# Altium schematic sheet Sitara_DDR.SchDoc
size A3; SheetNumber: 6; SheetTotal: 10
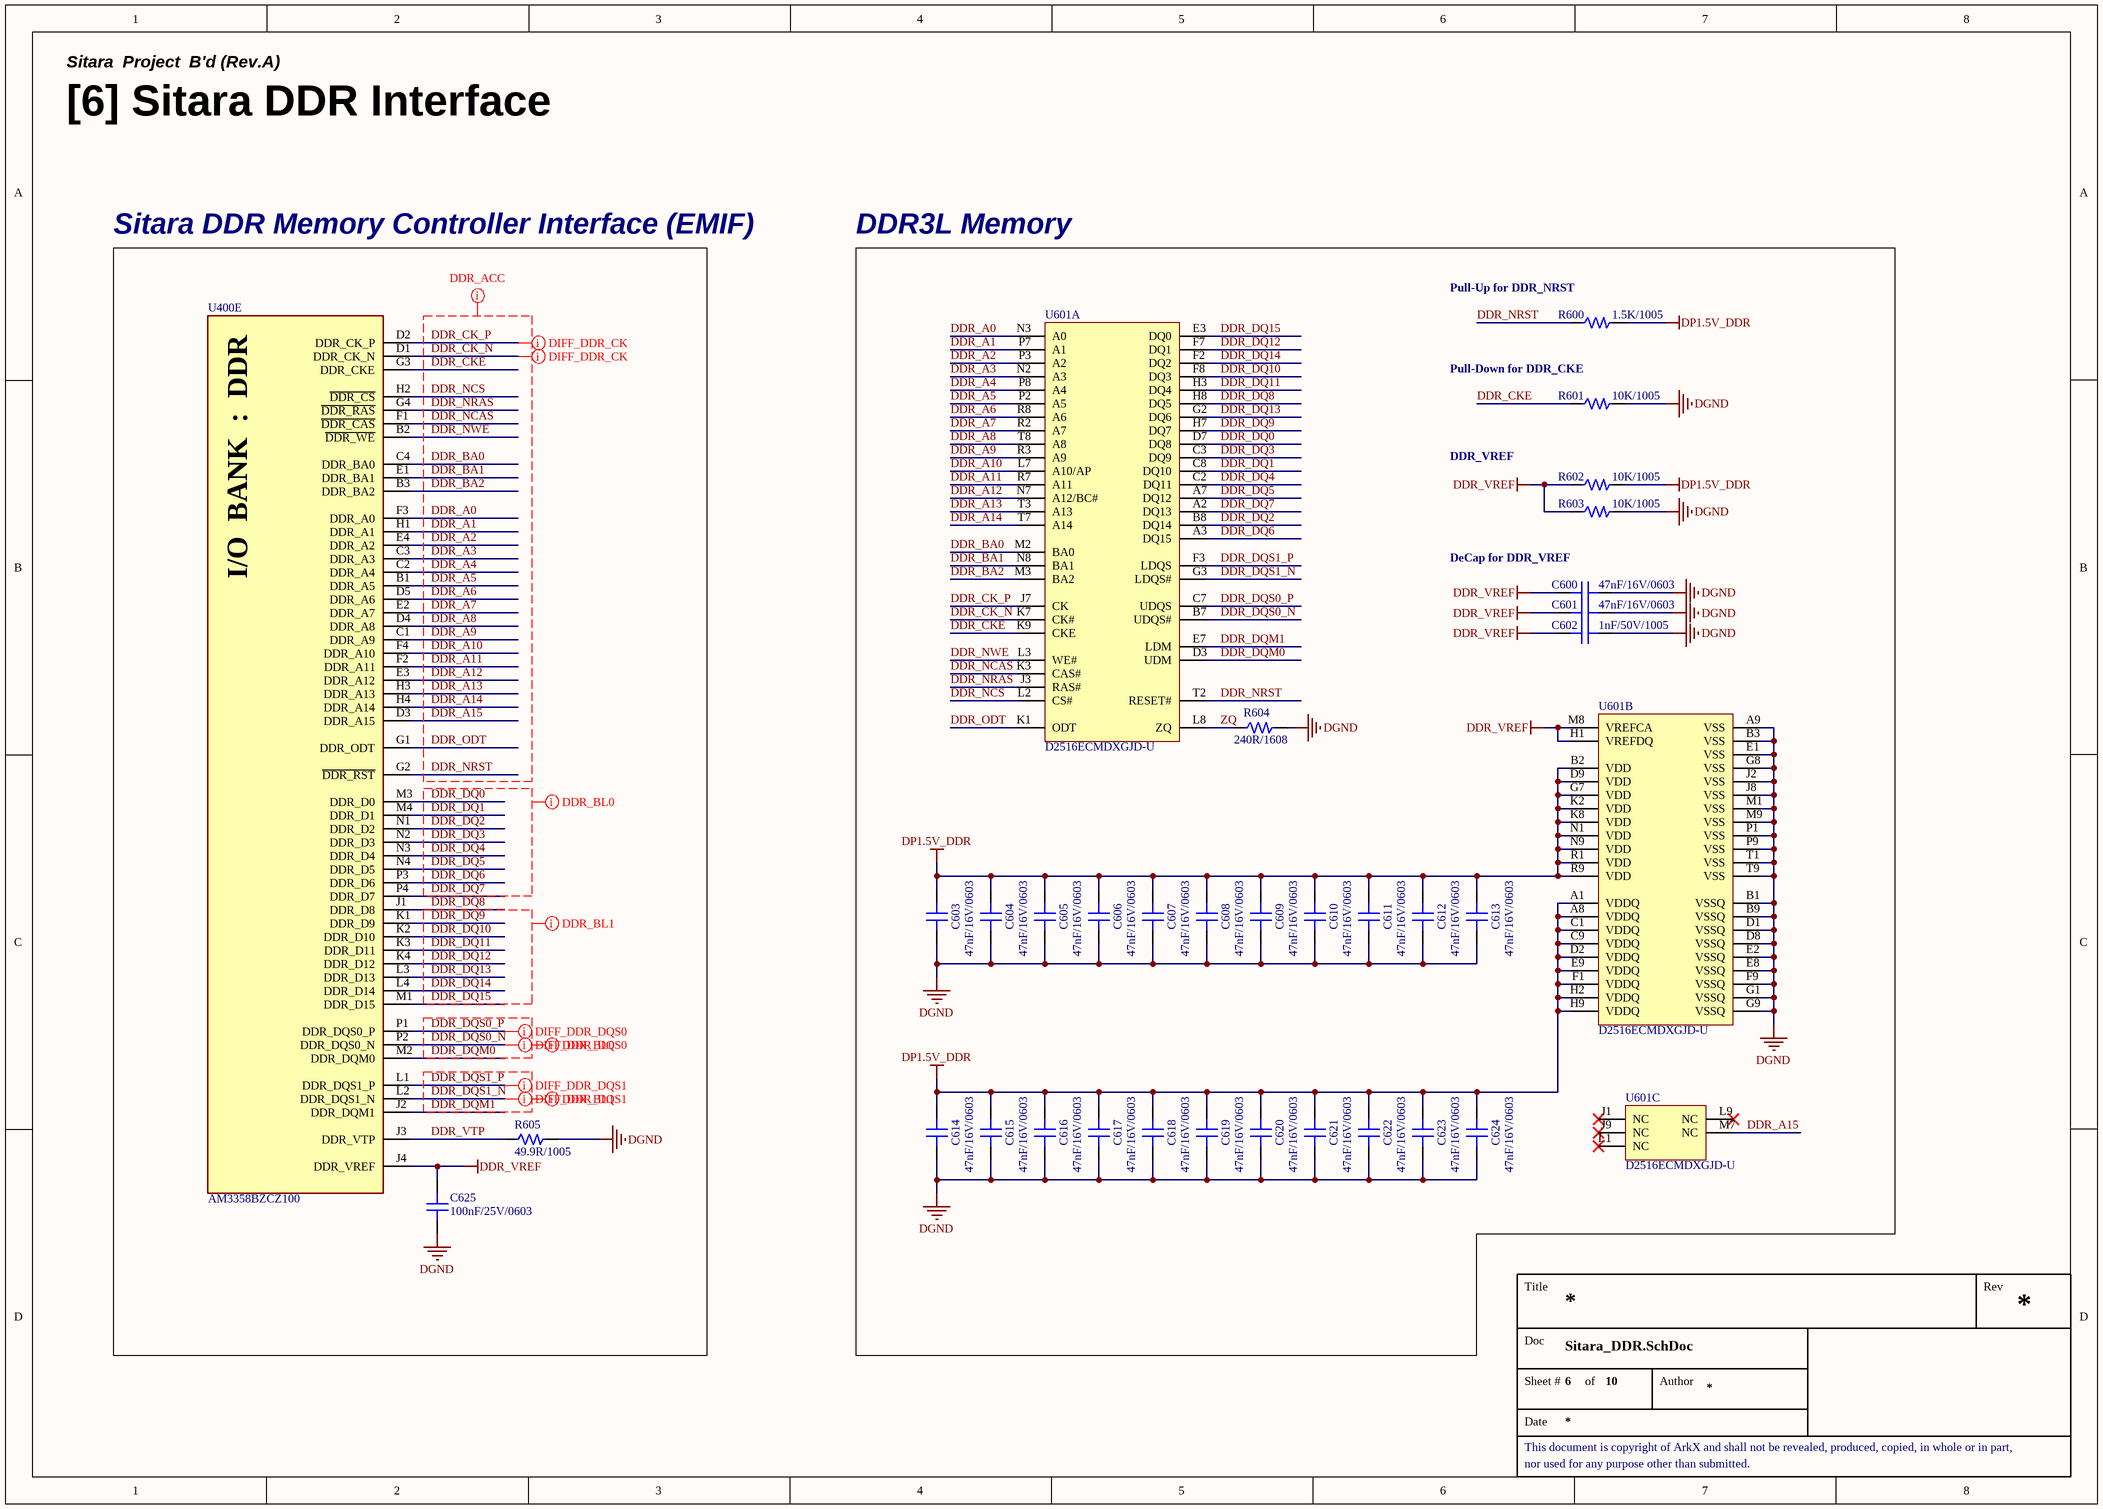
[diagram p0: Sitara_DDR.SchDoc]

## Parts
C600  47nF/16V/0603  [CAP 0603 (0201_INCH)]
C601  47nF/16V/0603  [CAP 0603 (0201_INCH)]
C602  1nF/50V/1005  [CAP 1005 (0402_INCH)]
C603  47nF/16V/0603  [CAP 0603 (0201_INCH)]
C604  47nF/16V/0603  [CAP 0603 (0201_INCH)]
C605  47nF/16V/0603  [CAP 0603 (0201_INCH)]
C606  47nF/16V/0603  [CAP 0603 (0201_INCH)]
C607  47nF/16V/0603  [CAP 0603 (0201_INCH)]
C608  47nF/16V/0603  [CAP 0603 (0201_INCH)]
C609  47nF/16V/0603  [CAP 0603 (0201_INCH)]
C610  47nF/16V/0603  [CAP 0603 (0201_INCH)]
C611  47nF/16V/0603  [CAP 0603 (0201_INCH)]
C612  47nF/16V/0603  [CAP 0603 (0201_INCH)]
C613  47nF/16V/0603  [CAP 0603 (0201_INCH)]
C614  47nF/16V/0603  [CAP 0603 (0201_INCH)]
C615  47nF/16V/0603  [CAP 0603 (0201_INCH)]
C616  47nF/16V/0603  [CAP 0603 (0201_INCH)]
C617  47nF/16V/0603  [CAP 0603 (0201_INCH)]
C618  47nF/16V/0603  [CAP 0603 (0201_INCH)]
C619  47nF/16V/0603  [CAP 0603 (0201_INCH)]
C620  47nF/16V/0603  [CAP 0603 (0201_INCH)]
C621  47nF/16V/0603  [CAP 0603 (0201_INCH)]
C622  47nF/16V/0603  [CAP 0603 (0201_INCH)]
C623  47nF/16V/0603  [CAP 0603 (0201_INCH)]
C624  47nF/16V/0603  [CAP 0603 (0201_INCH)]
C625  100nF/25V/0603  [CAP 0603 (0201_INCH)]
R600  1.5K/1005  [RES 1005 (0402_inch)]
R601  10K/1005  [RES 1005 (0402_inch)]
R602  10K/1005  [RES 1005 (0402_inch)]
R603  10K/1005  [RES 1005 (0402_inch)]
R604  240R/1608  [RES 1608 (0603_inch)]
R605  49.9R/1005  [RES 1005 (0402_inch)]
U400  AM3358BZCZ100  [IC_SOC_AM3358BZCZ100]  (part E of 8)
U601  D2516ECMDXGJD-U  [IC_MEM_DDR3L_MT41K256M16TW-107 IT:P]  (parts A,B,C of 3)

## Blocks framed on the sheet
Sitara DDR Memory Controller Interface (EMIF): C625 R605 U400
DDR3L Memory: C600-C624 R600-R604 U601

## Nets
DDR_VREF: C600.1 C601.1 C602.1 C625.2 R602.1 R603.1 U400.J4(DDR_VREF) U601.H1(VREFDQ) U601.M8(VREFCA)
DGND: C600.2 C601.2 C602.2 C603.1 C604.1 C605.1 C606.1 C607.1 C608.1 C609.1 C610.1 C611.1 C612.1 C613.1 C614.1 C615.1 C616.1 C617.1 C618.1 C619.1 C620.1 C621.1 C622.1 C623.1 C624.1 C625.1 R601.2 R603.2 R604.2 R605.2 U601.A9(VSS) U601.B1(VSSQ) U601.B3(VSS) U601.B9(VSSQ) U601.D1(VSSQ) U601.D8(VSSQ) U601.E1(VSS) U601.E2(VSSQ) U601.E8(VSSQ) U601.F9(VSSQ) U601.G1(VSSQ) U601.G8(VSS) U601.G9(VSSQ) U601.J2(VSS) U601.J8(VSS) U601.M1(VSS) U601.M9(VSS) U601.P1(VSS) U601.P9(VSS) U601.T1(VSS) U601.T9(VSS)
DP1.5V_DDR: C603.2 C604.2 C605.2 C606.2 C607.2 C608.2 C609.2 C610.2 C611.2 C612.2 C613.2 C614.2 C615.2 C616.2 C617.2 C618.2 C619.2 C620.2 C621.2 C622.2 C623.2 C624.2 R600.2 R602.2 U601.A1(VDDQ) U601.A8(VDDQ) U601.B2(VDD) U601.C1(VDDQ) U601.C9(VDDQ) U601.D2(VDDQ) U601.D9(VDD) U601.E9(VDDQ) U601.F1(VDDQ) U601.G7(VDD) U601.H2(VDDQ) U601.H9(VDDQ) U601.K2(VDD) U601.K8(VDD) U601.N1(VDD) U601.N9(VDD) U601.R1(VDD) U601.R9(VDD)
DDR_A0: U400.F3(DDR_A0) U601.N3(A0)
DDR_A1: U400.H1(DDR_A1) U601.P7(A1)
DDR_A2: U400.E4(DDR_A2) U601.P3(A2)
DDR_A3: U400.C3(DDR_A3) U601.N2(A3)
DDR_A4: U400.C2(DDR_A4) U601.P8(A4)
DDR_A5: U400.B1(DDR_A5) U601.P2(A5)
DDR_A6: U400.D5(DDR_A6) U601.R8(A6)
DDR_A7: U400.E2(DDR_A7) U601.R2(A7)
DDR_A8: U400.D4(DDR_A8) U601.T8(A8)
DDR_A9: U400.C1(DDR_A9) U601.R3(A9)
DDR_A10: U400.F4(DDR_A10) U601.L7(A10/AP)
DDR_A11: U400.F2(DDR_A11) U601.R7(A11)
DDR_A12: U400.E3(DDR_A12) U601.N7(A12/BC#)
DDR_A13: U400.H3(DDR_A13) U601.T3(A13)
DDR_A14: U400.H4(DDR_A14) U601.T7(A14)
DDR_A15: U400.D3(DDR_A15) U601.M7(NC)
DDR_BA0: U400.C4(DDR_BA0) U601.M2(BA0)
DDR_BA1: U400.E1(DDR_BA1) U601.N8(BA1)
DDR_BA2: U400.B3(DDR_BA2) U601.M3(BA2)
DDR_CK_N: U400.D1(DDR_CK_N) U601.K7(CK#)
DDR_CK_P: U400.D2(DDR_CK_P) U601.J7(CK)
DDR_CKE: R601.1 U400.G3(DDR_CKE) U601.K9(CKE)
DDR_DQ0: U400.M3(DDR_D0) U601.D7(DQ8)
DDR_DQ1: U400.M4(DDR_D1) U601.C8(DQ10)
DDR_DQ2: U400.N1(DDR_D2) U601.B8(DQ14)
DDR_DQ3: U400.N2(DDR_D3) U601.C3(DQ9)
DDR_DQ4: U400.N3(DDR_D4) U601.C2(DQ11)
DDR_DQ5: U400.N4(DDR_D5) U601.A7(DQ12)
DDR_DQ6: U400.P3(DDR_D6) U601.A3(DQ15)
DDR_DQ7: U400.P4(DDR_D7) U601.A2(DQ13)
DDR_DQ8: U400.J1(DDR_D8) U601.H8(DQ5)
DDR_DQ9: U400.K1(DDR_D9) U601.H7(DQ7)
DDR_DQ10: U400.K2(DDR_D10) U601.F8(DQ3)
DDR_DQ11: U400.K3(DDR_D11) U601.H3(DQ4)
DDR_DQ12: U400.K4(DDR_D12) U601.F7(DQ1)
DDR_DQ13: U400.L3(DDR_D13) U601.G2(DQ6)
DDR_DQ14: U400.L4(DDR_D14) U601.F2(DQ2)
DDR_DQ15: U400.M1(DDR_D15) U601.E3(DQ0)
DDR_DQM0: U400.M2(DDR_DQM0) U601.D3(UDM)
DDR_DQM1: U400.J2(DDR_DQM1) U601.E7(LDM)
DDR_DQS0_N: U400.P2(DDR_DQS0_N) U601.B7(UDQS#)
DDR_DQS0_P: U400.P1(DDR_DQS0_P) U601.C7(UDQS)
DDR_DQS1_N: U400.L2(DDR_DQS1_N) U601.G3(LDQS#)
DDR_DQS1_P: U400.L1(DDR_DQS1_P) U601.F3(LDQS)
DDR_NCAS: U400.F1(~{DDR_CAS}) U601.K3(CAS#)
DDR_NCS: U400.H2(~{DDR_CS}) U601.L2(CS#)
DDR_NRAS: U400.G4(~{DDR_RAS}) U601.J3(RAS#)
DDR_NRST: R600.1 U400.G2(~{DDR_RST}) U601.T2(RESET#)
DDR_NWE: U400.B2(~{DDR_WE}) U601.L3(WE#)
DDR_ODT: U400.G1(DDR_ODT) U601.K1(ODT)
DDR_VTP: R605.1 U400.J3(DDR_VTP)
ZQ: R604.1 U601.L8(ZQ)

Not connected (* = marked no-connect by the designer): U601 J1(NC)* J9(NC)* L1(NC)* L9(NC)*

## Layout directives
rule Matched Net Lengths [Delay Tolerance = 10ps]; net class DDR_ACC: DDR_A0, DDR_A1, DDR_A2, DDR_A3, DDR_A4, DDR_A5, DDR_A6, DDR_A7, DDR_A8, DDR_A9, DDR_A10, DDR_A11, DDR_A12, DDR_A13, DDR_A14, DDR_A15, DDR_BA0, DDR_BA1, DDR_BA2, DDR_CK_N, DDR_CK_P, DDR_CKE, DDR_NCAS, DDR_NCS, DDR_NRAS, DDR_NRST, DDR_NWE, DDR_ODT
differential pair; differential pair class DIFF_DDR_CK: DDR_CK_N, DDR_CK_P
differential pair; differential pair class DIFF_DDR_DQS0: DDR_DQS0_N, DDR_DQS0_P
differential pair; differential pair class DIFF_DDR_DQS1: DDR_DQS1_N, DDR_DQS1_P
rule Matched Net Lengths [Delay Tolerance = 10ps]; net class DDR_BL0: DDR_DQ0, DDR_DQ1, DDR_DQ2, DDR_DQ3, DDR_DQ4, DDR_DQ5, DDR_DQ6, DDR_DQ7, DDR_DQM0, DDR_DQS0_N, DDR_DQS0_P
rule Matched Net Lengths [Delay Tolerance = 10ps]; net class DDR_BL1: DDR_DQ8, DDR_DQ9, DDR_DQ10, DDR_DQ11, DDR_DQ12, DDR_DQ13, DDR_DQ14, DDR_DQ15, DDR_DQM1, DDR_DQS1_N, DDR_DQS1_P

## Notes on the sheet
- Sitara  Project  B'd (Rev.A)
- [6] Sitara DDR Interface
- (near R600) Pull-Up for DDR_NRST
- Pull-Down for DDR_CKE
- DDR_VREF
- DeCap for DDR_VREF
- Title
- Rev
- Doc
- Sheet #
- of
- Author
- This document is copyright of ArkX and shall not be revealed, produced, copied, in whole or in part,
- Date
- nor used for any purpose other than submitted.
- (in symbol IC_SOC_AM3358BZCZ100, part E) I/O  BANK  :  DDR

## Library data of the parts
C600 C601 C603-C624 = CAP_47nF/16V/0603: 16V 47nF X5R ±10% 0201 Multilayer Ceramic Capacitors MLCC - SMD/SMT ROHS; JLCPCB Part Type: Extended Part; LCSC Part #: C88917
C602 = CAP_1nF/50V/1005: Ceramic CAP_1nF/50V/1005; LCSC Part #: C1523; JLCPCB Part Type: Basic Part
C625 = CAP_100nF/25V/0603: Ceramic CAP_100nF/25V/0603; JLCPCB Part Type: Extended Part; LCSC Part #: C181047
R600 = RES_1.5K/1005/62.5mW: Value: 1.5K; Power Rating: 62.5mW; Precision: 1%; Size: 1005; LCSC Part #: C25867; JLCPCB Part Type: Basic Part
R601-R603 = RES_10K/1005/62.5mW: Value: 10K; Power Rating: 62.5mW; Precision: 1%; Size: 1005; LCSC Part #: C25744; JLCPCB Part Type: Basic Part
R604 = RES_240R/1608/0.1W: Value: 240R; Power Rating: 0.1W; Precision: 1%; Size: 1608; LCSC Part #: C23350; JLCPCB Part Type: Basic Part
R605 = RES_49.9R/1005/62.5mW: Value: 49.9R; Power Rating: 62.5mW; Precision: 1%; Size: 1005; LCSC Part #: C25120; JLCPCB Part Type: Basic Part
U400 = IC_SOC_AM3358BZCZ100: ARM® Cortex®-A8 Microprocessor IC Sitara™ 1 Core, 32-Bit 1.0GHz 324-NFBGA (15x15); LCSC Part #: C73932; JLCPCB Part Type: Extended Part
U601 = IC_MEM_DDR3L_D2516ECMDXGJD-U: DRAM 4Gb 96 ball FBGA DDR3L 1866; JLCPCB Part Type: Extended Part; LCSC Part #: C2927180